# Altium schematic sheet ShiftregisterTeil2.SchDoc
size A4
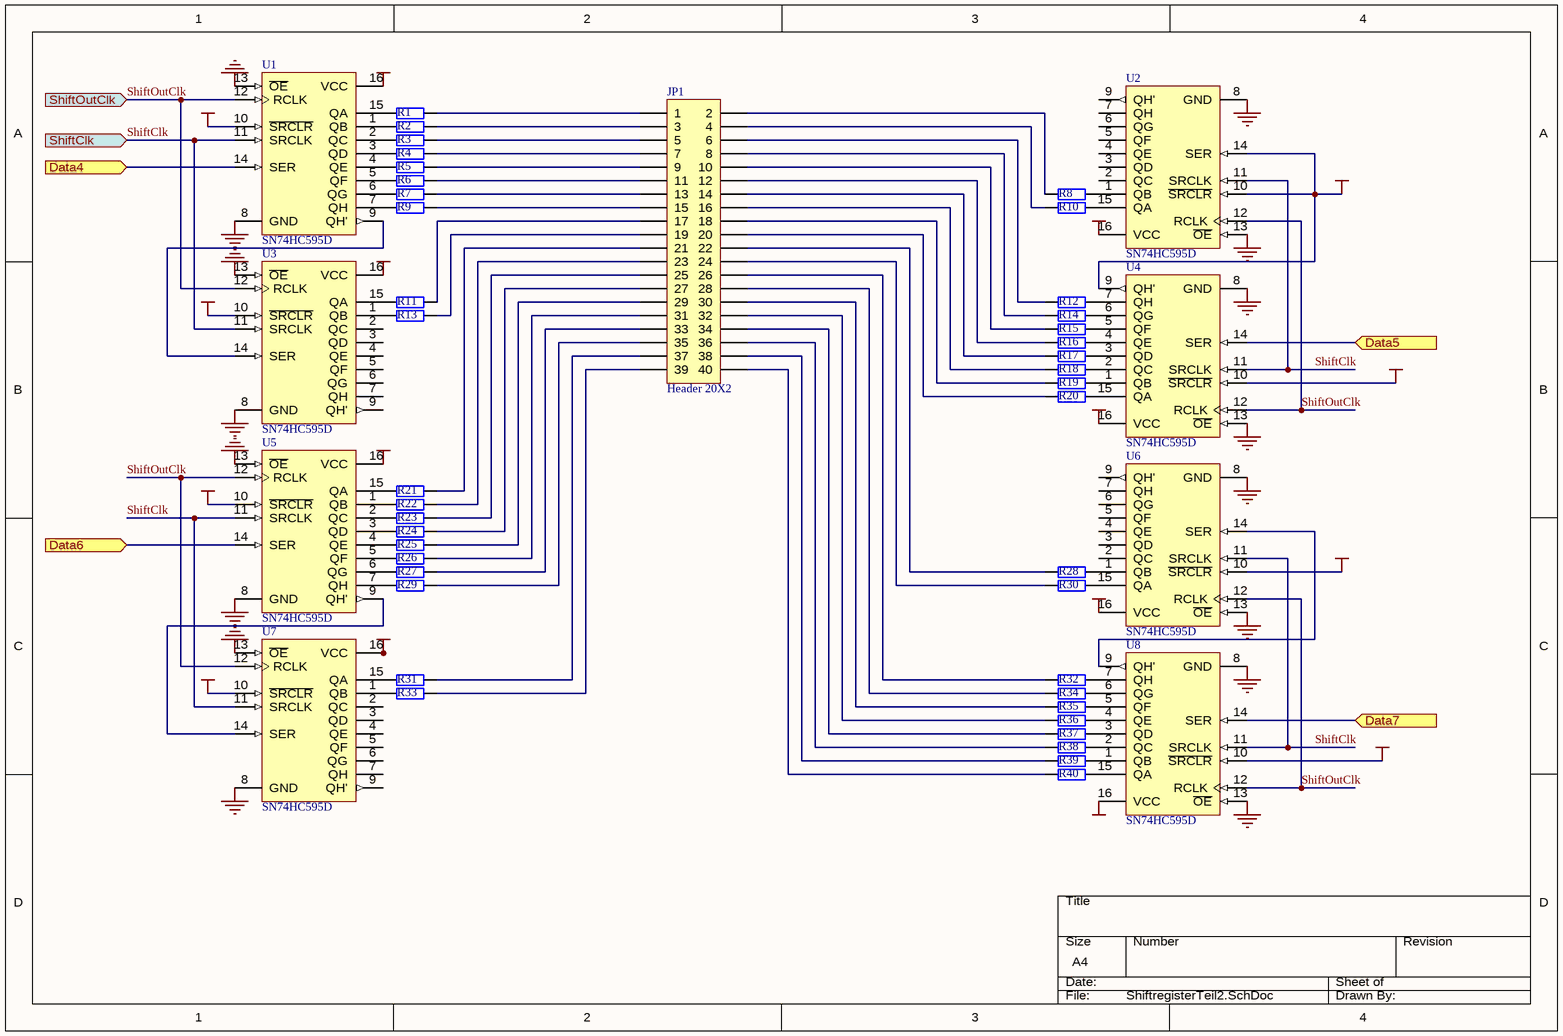
[diagram p0: ShiftregisterTeil2.SchDoc]

## Parts
JP1  Header 20X2  [HDR2X20]
R1  (no value)  [AXIAL-0.4]
R2  (no value)  [AXIAL-0.4]
R3  (no value)  [AXIAL-0.4]
R4  (no value)  [AXIAL-0.4]
R5  (no value)  [AXIAL-0.4]
R6  (no value)  [AXIAL-0.4]
R7  (no value)  [AXIAL-0.4]
R8  (no value)  [AXIAL-0.4]
R9  (no value)  [AXIAL-0.4]
R10  (no value)  [AXIAL-0.4]
R11  (no value)  [AXIAL-0.4]
R12  (no value)  [AXIAL-0.4]
R13  (no value)  [AXIAL-0.4]
R14  (no value)  [AXIAL-0.4]
R15  (no value)  [AXIAL-0.4]
R16  (no value)  [AXIAL-0.4]
R17  (no value)  [AXIAL-0.4]
R18  (no value)  [AXIAL-0.4]
R19  (no value)  [AXIAL-0.4]
R20  (no value)  [AXIAL-0.4]
R21  (no value)  [AXIAL-0.4]
R22  (no value)  [AXIAL-0.4]
R23  (no value)  [AXIAL-0.4]
R24  (no value)  [AXIAL-0.4]
R25  (no value)  [AXIAL-0.4]
R26  (no value)  [AXIAL-0.4]
R27  (no value)  [AXIAL-0.4]
R28  (no value)  [AXIAL-0.4]
R29  (no value)  [AXIAL-0.4]
R30  (no value)  [AXIAL-0.4]
R31  (no value)  [AXIAL-0.4]
R32  (no value)  [AXIAL-0.4]
R33  (no value)  [AXIAL-0.4]
R34  (no value)  [AXIAL-0.4]
R35  (no value)  [AXIAL-0.4]
R36  (no value)  [AXIAL-0.4]
R37  (no value)  [AXIAL-0.4]
R38  (no value)  [AXIAL-0.4]
R39  (no value)  [AXIAL-0.4]
R40  (no value)  [AXIAL-0.4]
U1  SN74HC595D  [D016]
U2  SN74HC595D  [D016]
U3  SN74HC595D  [D016]
U4  SN74HC595D  [D016]
U5  SN74HC595D  [D016]
U6  SN74HC595D  [D016]
U7  SN74HC595D  [D016]
U8  SN74HC595D  [D016]

## Ports
Data4 (in), Data5 (in), Data6 (in), Data7 (in), ShiftClk (in), ShiftOutClk (in)

## Nets
GND: U1.8(GND) U1.13(~{OE}) U2.8(GND) U2.13(~{OE}) U3.8(GND) U3.13(~{OE}) U4.8(GND) U4.13(~{OE}) U5.8(GND) U5.13(~{OE}) U6.8(GND) U6.13(~{OE}) U7.8(GND) U7.13(~{OE}) U8.8(GND) U8.13(~{OE})
VCC: U1.10(~{SRCLR}) U1.16(VCC) U2.10(~{SRCLR}) U2.14(SER) U2.16(VCC) U3.10(~{SRCLR}) U3.16(VCC) U4.9(QH') U4.10(~{SRCLR}) U4.16(VCC) U5.10(~{SRCLR}) U5.16(VCC) U6.10(~{SRCLR}) U6.16(VCC) U7.10(~{SRCLR}) U7.16(VCC) U8.10(~{SRCLR}) U8.16(VCC)
Data4: U1.14(SER) ; port Data4
Data5: U4.14(SER) ; port Data5
Data6: U5.14(SER) ; port Data6
Data7: U8.14(SER) ; port Data7
ShiftClk: U1.11(SRCLK) U2.11(SRCLK) U3.11(SRCLK) U4.11(SRCLK) U5.11(SRCLK) U6.11(SRCLK) U7.11(SRCLK) U8.11(SRCLK) ; port ShiftClk
ShiftOutClk: U1.12(RCLK) U2.12(RCLK) U3.12(RCLK) U4.12(RCLK) U5.12(RCLK) U6.12(RCLK) U7.12(RCLK) U8.12(RCLK) ; port ShiftOutClk
NetJP1_1: JP1.1 R1.2
NetJP1_2: JP1.2 R8.2
NetJP1_3: JP1.3 R2.2
NetJP1_4: JP1.4 R10.2
NetJP1_5: JP1.5 R3.2
NetJP1_6: JP1.6 R12.2
NetJP1_7: JP1.7 R4.2
NetJP1_8: JP1.8 R14.2
NetJP1_9: JP1.9 R5.2
NetJP1_10: JP1.10 R15.2
NetJP1_11: JP1.11 R6.2
NetJP1_12: JP1.12 R16.2
NetJP1_13: JP1.13 R7.2
NetJP1_14: JP1.14 R17.2
NetJP1_15: JP1.15 R9.2
NetJP1_16: JP1.16 R18.2
NetJP1_17: JP1.17 R11.2
NetJP1_18: JP1.18 R19.2
NetJP1_19: JP1.19 R13.2
NetJP1_20: JP1.20 R20.2
NetJP1_21: JP1.21 R21.2
NetJP1_22: JP1.22 R28.2
NetJP1_23: JP1.23 R22.2
NetJP1_24: JP1.24 R30.2
NetJP1_25: JP1.25 R23.2
NetJP1_26: JP1.26 R32.2
NetJP1_27: JP1.27 R24.2
NetJP1_28: JP1.28 R34.2
NetJP1_29: JP1.29 R25.2
NetJP1_30: JP1.30 R35.2
NetJP1_31: JP1.31 R26.2
NetJP1_32: JP1.32 R36.2
NetJP1_33: JP1.33 R27.2
NetJP1_34: JP1.34 R37.2
NetJP1_35: JP1.35 R29.2
NetJP1_36: JP1.36 R38.2
NetJP1_37: JP1.37 R31.2
NetJP1_38: JP1.38 R39.2
NetJP1_39: JP1.39 R33.2
NetJP1_40: JP1.40 R40.2
NetR1_1: R1.1 U1.15(QA)
NetR2_1: R2.1 U1.1(QB)
NetR3_1: R3.1 U1.2(QC)
NetR4_1: R4.1 U1.3(QD)
NetR5_1: R5.1 U1.4(QE)
NetR6_1: R6.1 U1.5(QF)
NetR7_1: R7.1 U1.6(QG)
NetR8_1: R8.1 U2.1(QB)
NetR9_1: R9.1 U1.7(QH)
NetR10_1: R10.1 U2.15(QA)
NetR11_1: R11.1 U3.15(QA)
NetR12_1: R12.1 U4.7(QH)
NetR13_1: R13.1 U3.1(QB)
NetR14_1: R14.1 U4.6(QG)
NetR15_1: R15.1 U4.5(QF)
NetR16_1: R16.1 U4.4(QE)
NetR17_1: R17.1 U4.3(QD)
NetR18_1: R18.1 U4.2(QC)
NetR19_1: R19.1 U4.1(QB)
NetR20_1: R20.1 U4.15(QA)
NetR21_1: R21.1 U5.15(QA)
NetR22_1: R22.1 U5.1(QB)
NetR23_1: R23.1 U5.2(QC)
NetR24_1: R24.1 U5.3(QD)
NetR25_1: R25.1 U5.4(QE)
NetR26_1: R26.1 U5.5(QF)
NetR27_1: R27.1 U5.6(QG)
NetR28_1: R28.1 U6.1(QB)
NetR29_1: R29.1 U5.7(QH)
NetR30_1: R30.1 U6.15(QA)
NetR31_1: R31.1 U7.15(QA)
NetR32_1: R32.1 U8.7(QH)
NetR33_1: R33.1 U7.1(QB)
NetR34_1: R34.1 U8.6(QG)
NetR35_1: R35.1 U8.5(QF)
NetR36_1: R36.1 U8.4(QE)
NetR37_1: R37.1 U8.3(QD)
NetR38_1: R38.1 U8.2(QC)
NetR39_1: R39.1 U8.1(QB)
NetR40_1: R40.1 U8.15(QA)
NetU1_9: U1.9(QH') U3.14(SER)
NetU5_9: U5.9(QH') U7.14(SER)
NetU6_14: U6.14(SER) U8.9(QH')

Not connected (* = marked no-connect by the designer): U2 2(QC) 3(QD) 4(QE) 5(QF) 6(QG) 7(QH) 9(QH'); U3 2(QC) 3(QD) 4(QE) 5(QF) 6(QG) 7(QH) 9(QH'); U6 2(QC) 3(QD) 4(QE) 5(QF) 6(QG) 7(QH) 9(QH'); U7 2(QC) 3(QD) 4(QE) 5(QF) 6(QG) 7(QH) 9(QH')

## Library data of the parts
JP1 = Header 20X2: Header, 20-Pin, Dual row; Revision: 17-Jul-2002: Re-released for DXP Platform.; Publisher: Altium Limited
R1-R40 = Res2: Resistor; Published: 8-Jun-2000; Revision: July-2002: Re-released for DXP Platform.; Publisher: Altium Limited
U1-U8 = SN74HC595D: 8-Bit Shift Register with 3-State Output Registers; Package Information: Latest Revision: Jan-1998; Published: 8-Jun-2000; Revision: 17-Jul-2002: Re-released for DXP Platform.; Datasheet: Latest Revision: May-1997; Package Reference: D016; Publisher: Altium Limited